# EAGLE schematic 31813A (EAGLE 7.5.0)

## Sheet 1 of 2
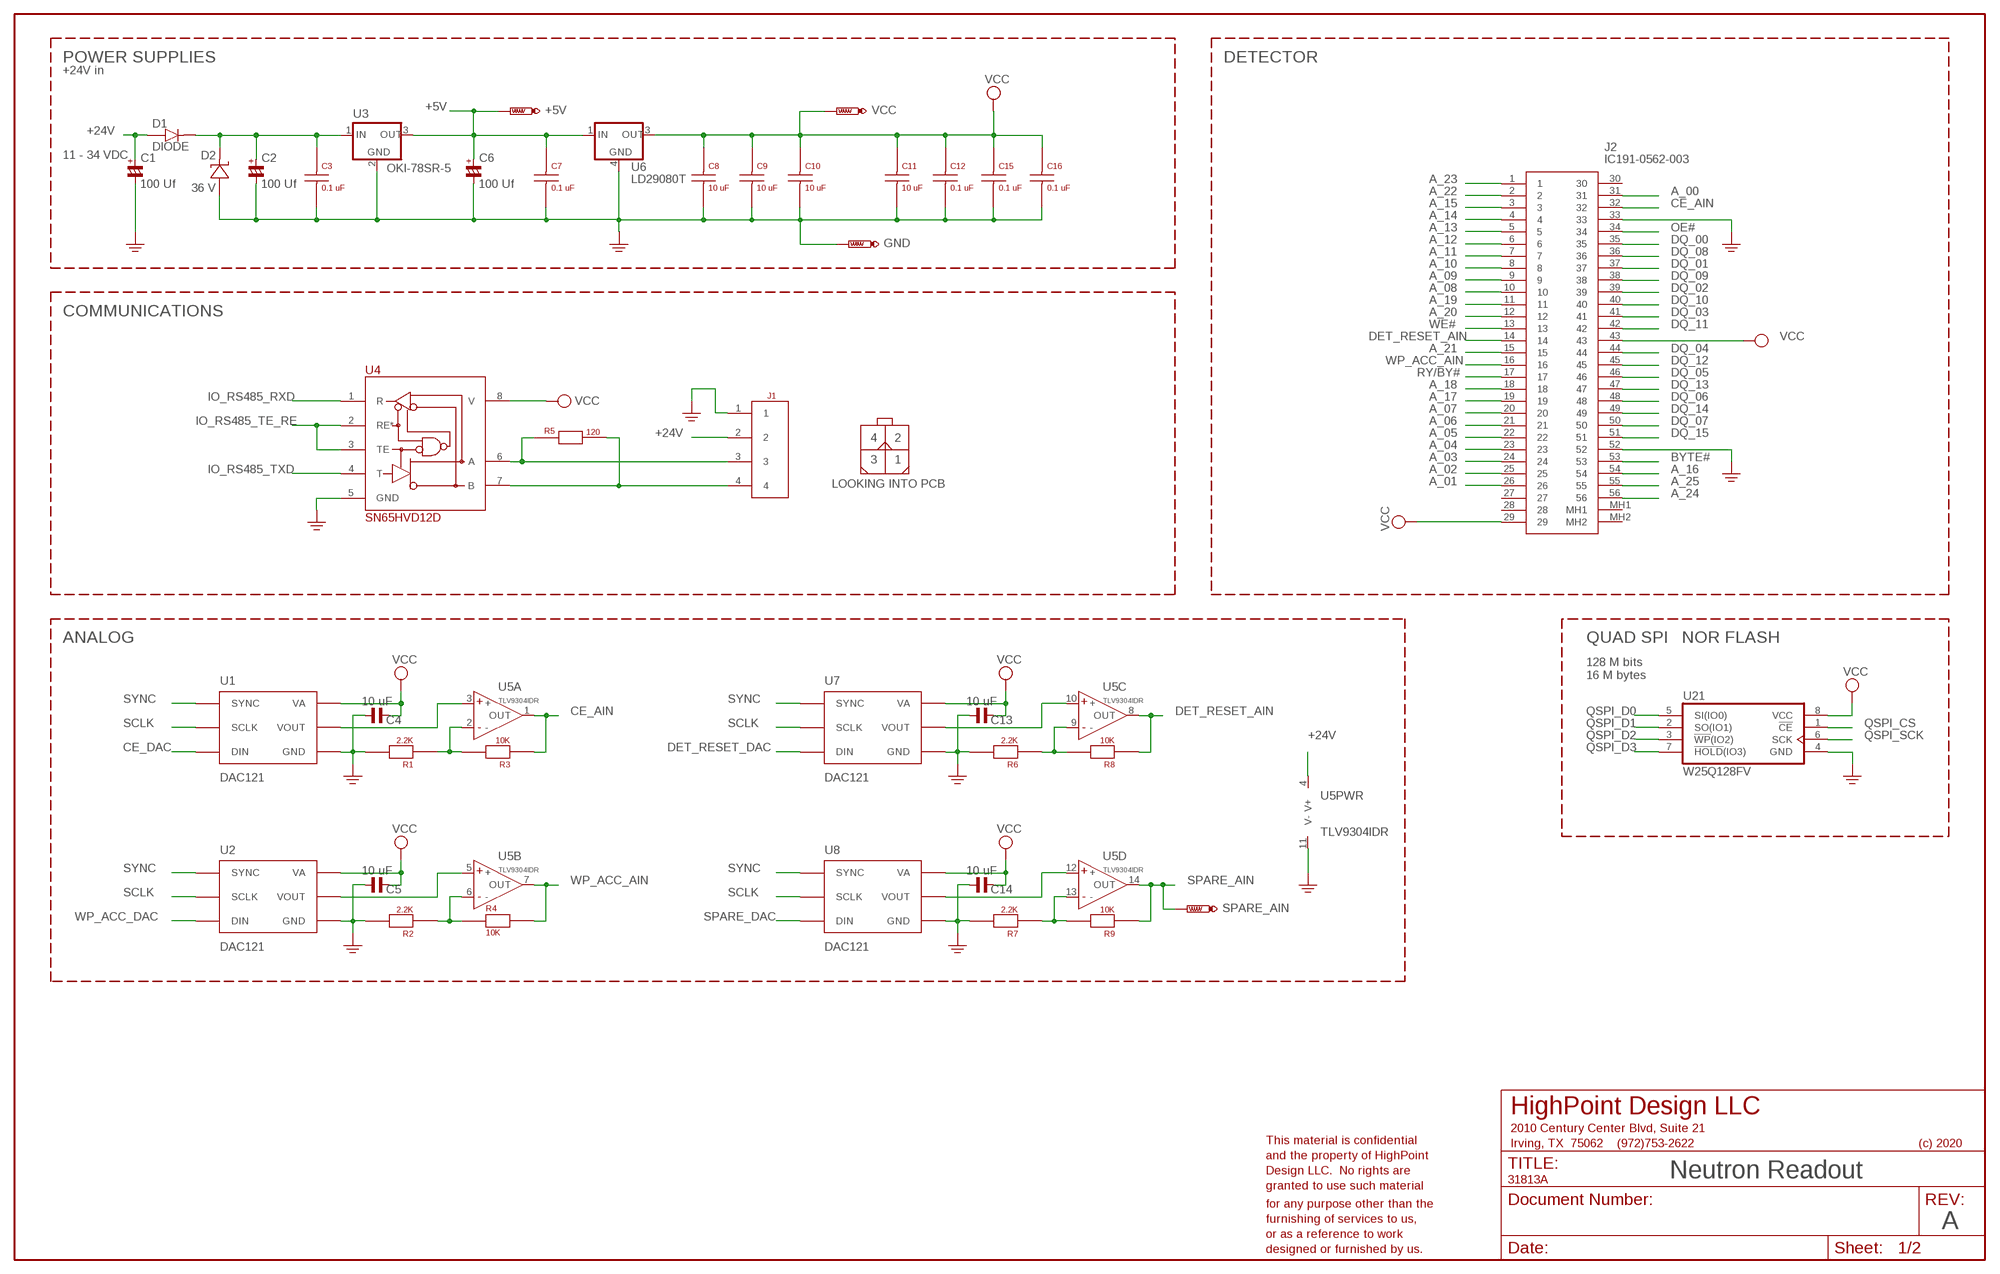
[diagram p0: schematic, sheet 1]

### Parts
+5V  TP  [TP8040]
C1  100 Uf  CAP_POL-E  [CSV-E/F]
C2  100 Uf  CAP_POL-E  [CSV-E/F]
C3  0.1 uF  CAP-0603  [0603]
C4  10 uF  CAP_SMD-0603  [0603]
C5  10 uF  CAP_SMD-0603  [0603]
C6  100 Uf  CAP_POL-E  [CSV-E/F]
C7  0.1 uF  CAP-0603  [0603]
C8  10 uF  CAP-0603  [0603]
C9  10 uF  CAP-0603  [0603]
C10  10 uF  CAP-0603  [0603]
C11  10 uF  CAP-0603  [0603]
C12  0.1 uF  CAP-0603  [0603]
C13  10 uF  CAP_SMD-0603  [0603]
C14  10 uF  CAP_SMD-0603  [0603]
C15  0.1 uF  CAP-0603  [0603]
C16  0.1 uF  CAP-0603  [0603]
D1  DIODE  [SOD-123_MINI-SMA]
D2  36 V  TRANSORB  [SMB]
GND  TP  [TP8040]
J1  MICRO-FIT-4POS  [43045-0412]
J2  IC191-0562-003  [IC1910562003]
R1  2.2K  RES-0603-H  [0603]
R2  2.2K  RES-0603-H  [0603]
R3  10K  RES-0603-H  [0603]
R4  10K  RES-0603-H  [0603]
R5  120  RES-0603-H  [0603]
R6  2.2K  RES-0603-H  [0603]
R7  2.2K  RES-0603-H  [0603]
R8  10K  RES-0603-H  [0603]
R9  10K  RES-0603-H  [0603]
SPARE_AIN  TP  [TP8040]
U1  DAC121  [SOT23-6]
U2  DAC121  [SOT23-6]
U3  OKI-78SR-5  PS-OKI-78SR  [PS-OKI-78SR]
U4  SN65HVD12D  [SOIC-08-150]
U5  TLV9304IDR  [SO14]
U6  LD29080T  [DPAK]
U7  DAC121  [SOT23-6]
U8  DAC121  [SOT23-6]
U21  W25Q128FV  IS25LQ080B-JB  [SO08-JB]
VCC  TP  [TP8040]

### Nets
+5V: +5V.1(TP) C6.+ C7.1 U3.3(OUT) U6.1(IN) ; also sheet 2
+24V: C1.+ D1.A J1.2 U5.4(PWR:V+)
A_00: J2.31 ; also sheet 2
A_01: J2.26 ; also sheet 2
A_02: J2.25 ; also sheet 2
A_03: J2.24 ; also sheet 2
A_04: J2.23 ; also sheet 2
A_05: J2.22 ; also sheet 2
A_06: J2.21 ; also sheet 2
A_07: J2.20 ; also sheet 2
A_08: J2.10 ; also sheet 2
A_09: J2.9 ; also sheet 2
A_10: J2.8 ; also sheet 2
A_11: J2.7 ; also sheet 2
A_12: J2.6 ; also sheet 2
A_13: J2.5 ; also sheet 2
A_14: J2.4 ; also sheet 2
A_15: J2.3 ; also sheet 2
A_16: J2.54 ; also sheet 2
A_17: J2.19 ; also sheet 2
A_18: J2.18 ; also sheet 2
A_19: J2.11 ; also sheet 2
A_20: J2.12 ; also sheet 2
A_21: J2.15 ; also sheet 2
A_22: J2.2 ; also sheet 2
A_23: J2.1 ; also sheet 2
A_24: J2.56 ; also sheet 2
A_25: J2.55 ; also sheet 2
BYTE#: J2.53 ; also sheet 2
CE_AIN: J2.32 R3.1 U5.1(A:OUT)
CE_DAC: U1.4(DIN) ; also sheet 2
DATA_A: J1.3 R5.1 U4.6(A)
DATA_B: J1.4 R5.2 U4.7(B)
DET_RESET_AIN: J2.14 R8.1 U5.8(C:OUT)
DET_RESET_DAC: U7.4(DIN) ; also sheet 2
DQ_00: J2.35 ; also sheet 2
DQ_01: J2.37 ; also sheet 2
DQ_02: J2.39 ; also sheet 2
DQ_03: J2.41 ; also sheet 2
DQ_04: J2.44 ; also sheet 2
DQ_05: J2.46 ; also sheet 2
DQ_06: J2.48 ; also sheet 2
DQ_07: J2.50 ; also sheet 2
DQ_08: J2.36 ; also sheet 2
DQ_09: J2.38 ; also sheet 2
DQ_10: J2.40 ; also sheet 2
DQ_11: J2.42 ; also sheet 2
DQ_12: J2.45 ; also sheet 2
DQ_13: J2.47 ; also sheet 2
DQ_14: J2.49 ; also sheet 2
DQ_15: J2.51 ; also sheet 2
GND: C1.- C2.- C3.2 C4.1 C5.1 C6.- C7.2 C8.2 C9.2 C10.2 C11.2 C12.2 C13.1 C14.1 C15.2 C16.2 D2.A GND.1(TP) J1.1 J2.33 J2.52 R1.2 R2.2 R6.2 R7.2 U1.2(GND) U2.2(GND) U3.2(GND) U4.5(GND) U5.11(PWR:V-) U6.4(GND) U7.2(GND) U8.2(GND) U21.4(GND) ; supply symbol labelled GND-DIGITAL ; also sheet 2
IO_RS485_RXD: U4.1(R) ; also sheet 2
IO_RS485_TE_RE: U4.2(RE*) U4.3(TE) ; also sheet 2
IO_RS485_TXD: U4.4(T) ; also sheet 2
N$9: U1.1(VOUT) U5.3(A:+)
N$10: U5.10(C:+) U7.1(VOUT)
N$16: R1.1 R3.2 U5.2(A:-)
N$17: U2.1(VOUT) U5.5(B:+)
N$18: R6.1 R8.2 U5.9(C:-)
N$19: R2.1 R4.1 U5.6(B:-)
N$20: U5.12(D:+) U8.1(VOUT)
N$21: R7.1 R9.2 U5.13(D:-)
N$22: C2.+ C3.1 D1.C D2.C U3.1(IN)
OE#: J2.34 ; also sheet 2
QSPI_CS: U21.1(!CE!) ; also sheet 2
QSPI_D0: U21.5(SI(IO0)) ; also sheet 2
QSPI_D1: U21.2(SO(IO1)) ; also sheet 2
QSPI_D2: U21.3(!WP!(IO2)) ; also sheet 2
QSPI_D3: U21.7(!HOLD!(IO3)) ; also sheet 2
QSPI_SCK: U21.6(SCK) ; also sheet 2
RY/BY#: J2.17 ; also sheet 2
SCLK: U1.5(SCLK) U2.5(SCLK) U7.5(SCLK) U8.5(SCLK) ; also sheet 2
SPARE_AIN: R9.1 SPARE_AIN.1(TP) U5.14(D:OUT)
SPARE_DAC: U8.4(DIN) ; also sheet 2
SYNC: U1.6(SYNC) U2.6(SYNC) U7.6(SYNC) U8.6(SYNC) ; also sheet 2
VCC: C4.2 C5.2 C8.1 C9.1 C10.1 C11.1 C12.1 C13.2 C14.2 C15.1 C16.1 J2.29 J2.43 U1.3(VA) U2.3(VA) U4.8(V) U6.3(OUT) U7.3(VA) U8.3(VA) U21.8(VCC) VCC.1(TP) ; also sheet 2
WE#: J2.13 ; also sheet 2
WP_ACC_AIN: J2.16 R4.2 U5.7(B:OUT)
WP_ACC_DAC: U2.4(DIN) ; also sheet 2
Unconnected: J2.27 J2.28 J2.30 J2.MH1 J2.MH2

### Notes on the sheet
- POWER SUPPLIES | DETECTOR
- +24V in
- 11 - 34 VDC
- COMMUNICATIONS
- ANALOG | QUAD SPI   NOR FLASH
- 128 M bits
  16 M bytes
- Neutron Readout
- A

## Sheet 2 of 2
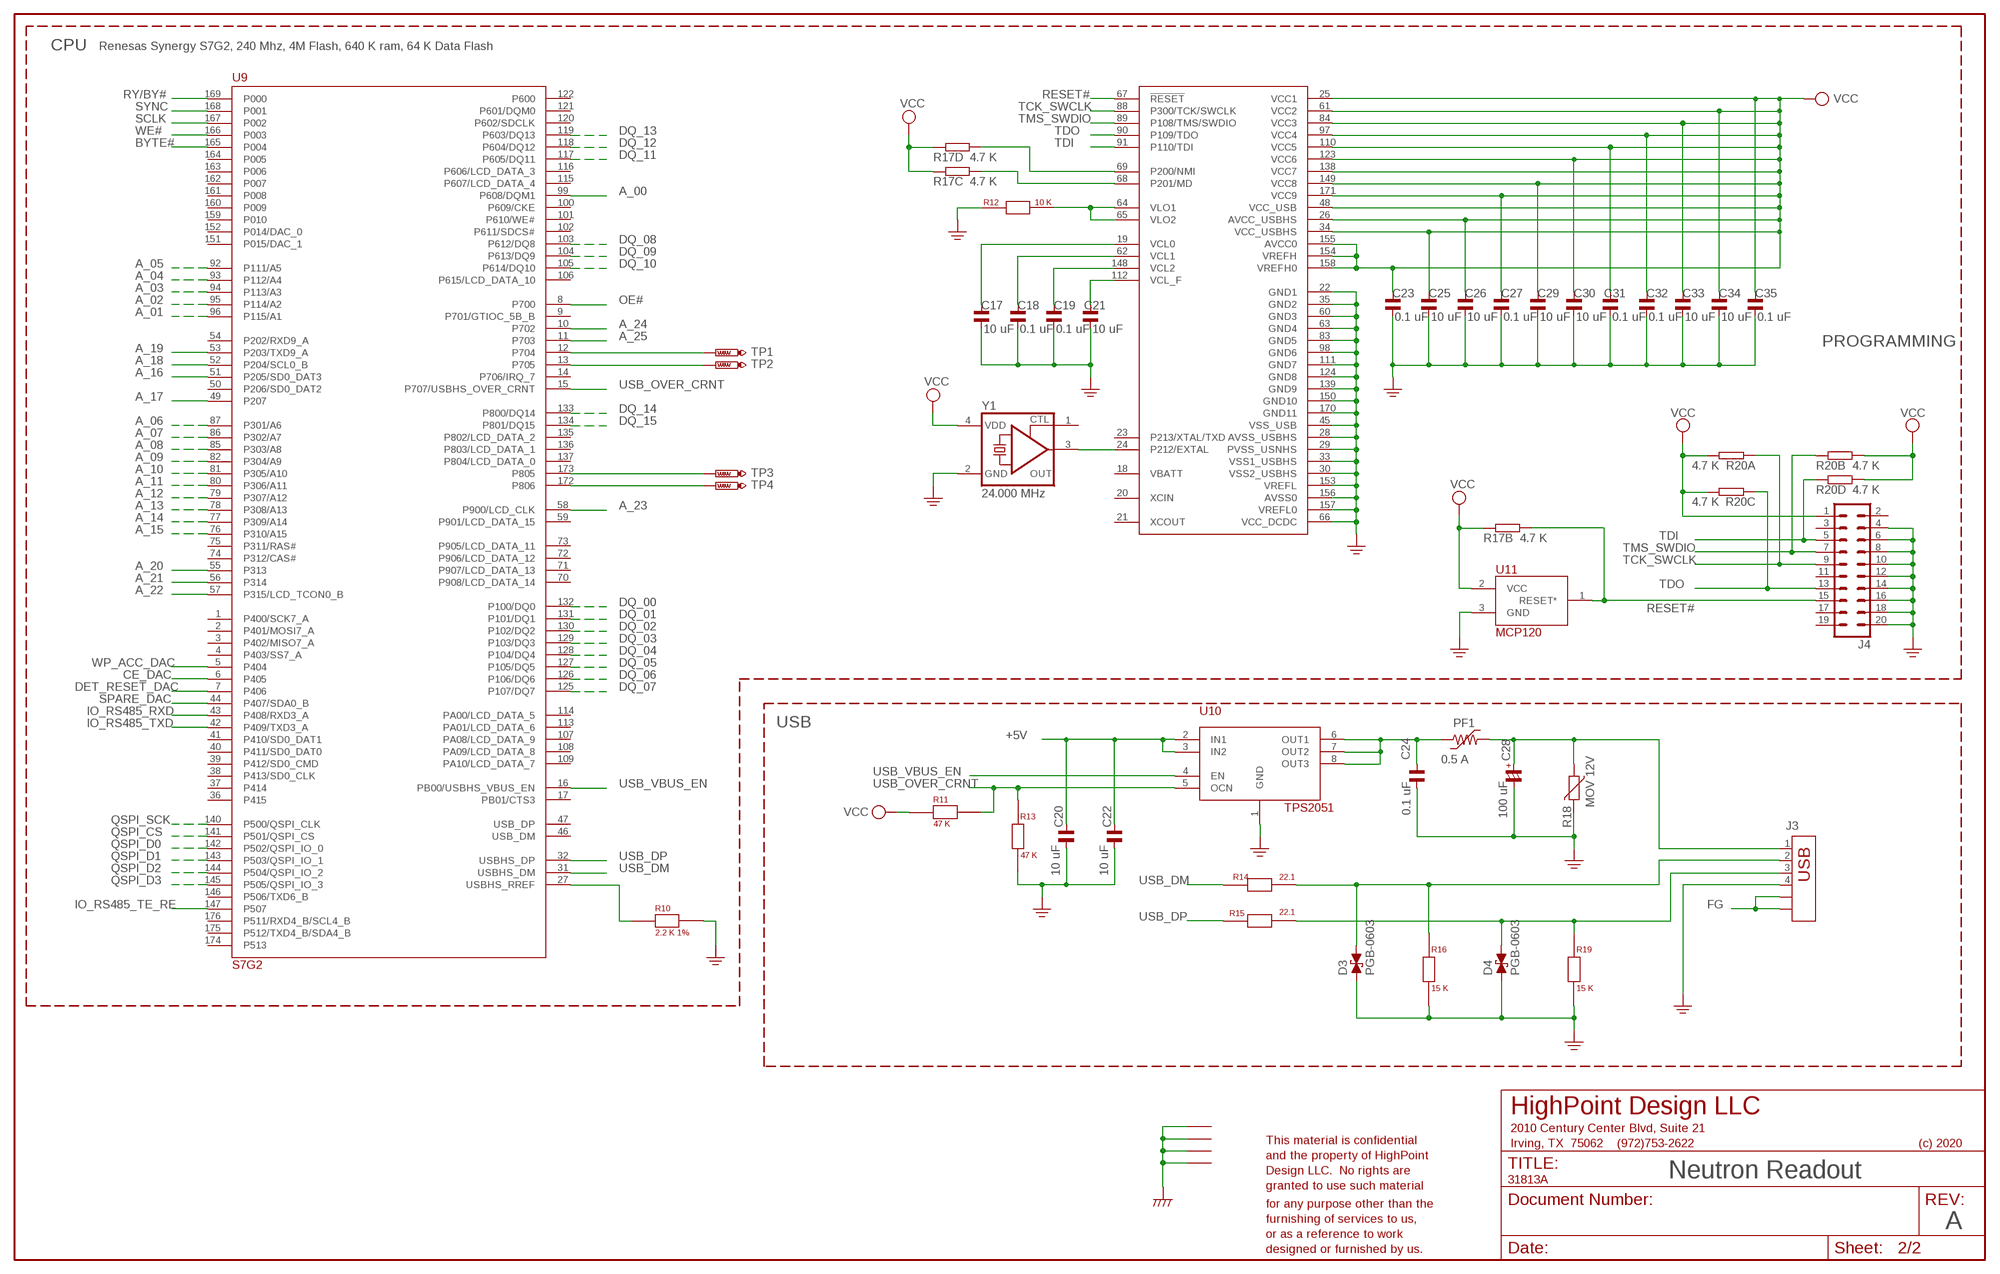
[diagram p1: schematic, sheet 2]

### Parts
C17  10 uF  CAP_SMD-0603  [0603]
C18  0.1 uF  CAP_SMD-0603  [0603]
C19  0.1 uF  CAP_SMD-0603  [0603]
C20  10 uF  CAP_SMD-0603  [0603]
C21  10 uF  CAP_SMD-0603  [0603]
C22  10 uF  CAP_SMD-0603  [0603]
C23  0.1 uF  CAP_SMD-0603  [0603]
C24  0.1 uF  CAP_SMD-0603  [0603]
C25  10 uF  CAP_SMD-0603  [0603]
C26  10 uF  CAP_SMD-0603  [0603]
C27  0.1 uF  CAP_SMD-0603  [0603]
C28  100 uF  CAP_POL-E  [CSV-E/F]
C29  10 uF  CAP_SMD-0603  [0603]
C30  10 uF  CAP_SMD-0603  [0603]
C31  0.1 uF  CAP_SMD-0603  [0603]
C32  0.1 uF  CAP_SMD-0603  [0603]
C33  10 uF  CAP_SMD-0603  [0603]
C34  10 uF  CAP_SMD-0603  [0603]
C35  0.1 uF  CAP_SMD-0603  [0603]
D3  PGB-0603  [PGB-0603]
D4  PGB-0603  [PGB-0603]
J3  CON-USB-292303-1  [USB]
J4  ML20  [ML20]
M1  MNT-125  [MNT-125]
M2  MNT-125  [MNT-125]
M3  MNT-125  [MNT-125]
M4  MNT-125  [MNT-125]
PF1  0.5 A  PTC-F1206  [F1206]
R10  2.2 K 1%  RES-0603-H  [0603]
R11  47 K  RES-0603-H  [0603]
R12  10 K  RES-0603-H  [0603]
R13  47 K  RES-0603-V  [0603]
R14  22.1  RES-0603-H  [0603]
R15  22.1  RES-0603-H  [0603]
R16  15 K  RES-0603-V  [0603]
R17  4.7 K  R_38V  [RNET-4R-38V]
R18  MOV 12V  VARISTOR-0603  [R0603]
R19  15 K  RES-0603-V  [0603]
R20  4.7 K  R_38V  [RNET-4R-38V]
TP1  TP  [TP8040]
TP2  TP  [TP8040]
TP3  TP  [TP8040]
TP4  TP  [TP8040]
U9  S7G2  S7G2-176  [LQFP176]
U10  TPS2051  [SOIC-8-SPECIAL]
U11  MCP120  [SOT23]
Y1  24.000 MHz  ASFL1  [ASFL1]

### Nets
+5V: C20.2 C22.2 U10.2(IN1) U10.3(IN2) ; also sheet 1
A_00: U9.99(P608/DQM1) ; also sheet 1
A_01: U9.96(P115/A1) ; also sheet 1
A_02: U9.95(P114/A2) ; also sheet 1
A_03: U9.94(P113/A3) ; also sheet 1
A_04: U9.93(P112/A4) ; also sheet 1
A_05: U9.92(P111/A5) ; also sheet 1
A_06: U9.87(P301/A6) ; also sheet 1
A_07: U9.86(P302/A7) ; also sheet 1
A_08: U9.85(P303/A8) ; also sheet 1
A_09: U9.82(P304/A9) ; also sheet 1
A_10: U9.81(P305/A10) ; also sheet 1
A_11: U9.80(P306/A11) ; also sheet 1
A_12: U9.79(P307/A12) ; also sheet 1
A_13: U9.78(P308/A13) ; also sheet 1
A_14: U9.77(P309/A14) ; also sheet 1
A_15: U9.76(P310/A15) ; also sheet 1
A_16: U9.51(P205/SD0_DAT3) ; also sheet 1
A_17: U9.49(P207) ; also sheet 1
A_18: U9.52(P204/SCL0_B) ; also sheet 1
A_19: U9.53(P203/TXD9_A) ; also sheet 1
A_20: U9.55(P313) ; also sheet 1
A_21: U9.56(P314) ; also sheet 1
A_22: U9.57(P315/LCD_TCON0_B) ; also sheet 1
A_23: U9.58(P900/LCD_CLK) ; also sheet 1
A_24: U9.10(P702) ; also sheet 1
A_25: U9.11(P703) ; also sheet 1
BYTE#: U9.165(P004) ; also sheet 1
CE_DAC: U9.6(P405) ; also sheet 1
DET_RESET_DAC: U9.7(P406) ; also sheet 1
DQ_00: U9.132(P100/DQ0) ; also sheet 1
DQ_01: U9.131(P101/DQ1) ; also sheet 1
DQ_02: U9.130(P102/DQ2) ; also sheet 1
DQ_03: U9.129(P103/DQ3) ; also sheet 1
DQ_04: U9.128(P104/DQ4) ; also sheet 1
DQ_05: U9.127(P105/DQ5) ; also sheet 1
DQ_06: U9.126(P106/DQ6) ; also sheet 1
DQ_07: U9.125(P107/DQ7) ; also sheet 1
DQ_08: U9.103(P612/DQ8) ; also sheet 1
DQ_09: U9.104(P613/DQ9) ; also sheet 1
DQ_10: U9.105(P614/DQ10) ; also sheet 1
DQ_11: U9.117(P605/DQ11) ; also sheet 1
DQ_12: U9.118(P604/DQ12) ; also sheet 1
DQ_13: U9.119(P603/DQ13) ; also sheet 1
DQ_14: U9.133(P800/DQ14) ; also sheet 1
DQ_15: U9.134(P801/DQ15) ; also sheet 1
FG: J3.S1 J3.S2 M1.1 M2.1 M3.1 M4.1
GND: C17.1 C18.1 C19.1 C20.1 C21.1 C22.1 C23.1 C24.1 C25.1 C26.1 C27.1 C28.- C29.1 C30.1 C31.1 C32.1 C33.1 C34.1 C35.1 D3.1 D4.1 J3.4 J4.4 J4.6 J4.8 J4.10 J4.12 J4.14 J4.16 J4.18 J4.20 R10.2 R12.1 R13.1 R16.1 R18.2 R19.1 U9.22(GND1) U9.28(AVSS_USBHS) U9.29(PVSS_USNHS) U9.30(VSS2_USBHS) U9.33(VSS1_USBHS) U9.35(GND2) U9.45(VSS_USB) U9.60(GND3) U9.63(GND4) U9.66(VCC_DCDC) U9.83(GND5) U9.98(GND6) U9.111(GND7) U9.124(GND8) U9.139(GND9) U9.150(GND10) U9.153(VREFL) U9.156(AVSS0) U9.157(VREFL0) U9.170(GND11) U10.1(GND) U11.3(GND) Y1.2(GND) ; supply symbol labelled GND-DIGITAL ; also sheet 1
IO_RS485_RXD: U9.43(P408/RXD3_A) ; also sheet 1
IO_RS485_TE_RE: U9.147(P507) ; also sheet 1
IO_RS485_TXD: U9.42(P409/TXD3_A) ; also sheet 1
N$1: R12.2 U9.64(VLO1) U9.65(VLO2)
N$2: R17.6 U9.68(P201/MD)
N$3: R17.5 U9.69(P200/NMI)
N$4: C17.2 U9.19(VCL0)
N$5: C18.2 U9.62(VCL1)
N$6: C19.2 U9.148(VCL2)
N$7: C21.2 U9.112(VCL_F)
N$8: U9.24(P212/EXTAL) Y1.3(OUT)
N$11: C24.2 PF1.1 U10.6(OUT1) U10.7(OUT2) U10.8(OUT3)
N$12: C28.+ J3.1 PF1.2 R18.1
N$13: D3.2 J3.2 R14.2 R16.2
N$14: R10.1 U9.27(USBHS_RREF)
N$15: D4.2 J3.3 R15.2 R19.2
N$23: TP3.1(TP) U9.173(P805)
N$24: TP4.1(TP) U9.172(P806)
N$25: TP1.1(TP) U9.12(P704)
N$26: TP2.1(TP) U9.13(P705)
OE#: U9.8(P700) ; also sheet 1
QSPI_CS: U9.141(P501/QSPI_CS) ; also sheet 1
QSPI_D0: U9.142(P502/QSPI_IO_0) ; also sheet 1
QSPI_D1: U9.143(P503/QSPI_IO_1) ; also sheet 1
QSPI_D2: U9.144(P504/QSPI_IO_2) ; also sheet 1
QSPI_D3: U9.145(P505/QSPI_IO_3) ; also sheet 1
QSPI_SCK: U9.140(P500/QSPI_CLK) ; also sheet 1
RESET#: J4.15 R17.7 U9.67(!RESET) U11.1(RESET*)
RY/BY#: U9.169(P000) ; also sheet 1
SCLK: U9.167(P002) ; also sheet 1
SPARE_DAC: U9.44(P407/SDA0_B) ; also sheet 1
SYNC: U9.168(P001) ; also sheet 1
TCK_SWCLK: J4.9 R20.1 U9.88(P300/TCK/SWCLK)
TDI: J4.5 R20.4 U9.91(P110/TDI)
TDO: J4.13 R20.3 U9.90(P109/TDO)
TMS_SWDIO: J4.7 R20.2 U9.89(P108/TMS/SWDIO)
USB_DM: R14.1 U9.31(USBHS_DM)
USB_DP: R15.1 U9.32(USBHS_DP)
USB_OVER_CRNT: R11.2 R13.2 U9.15(P707/USBHS_OVER_CRNT) U10.5(OCN)
USB_VBUS_EN: U9.16(PB00/USBHS_VBUS_EN) U10.4(EN)
VCC: C23.2 C25.2 C26.2 C27.2 C29.2 C30.2 C31.2 C32.2 C33.2 C34.2 C35.2 J4.1 R11.1 R17.2 R17.3 R17.4 R20.5 R20.6 R20.7 R20.8 U9.25(VCC1) U9.26(AVCC_USBHS) U9.34(VCC_USBHS) U9.48(VCC_USB) U9.61(VCC2) U9.84(VCC3) U9.97(VCC4) U9.110(VCC5) U9.123(VCC6) U9.138(VCC7) U9.149(VCC8) U9.154(VREFH) U9.155(AVCC0) U9.158(VREFH0) U9.171(VCC9) U11.2(VCC) Y1.4(VDD) ; also sheet 1
WE#: U9.166(P003) ; also sheet 1
WP_ACC_DAC: U9.5(P404) ; also sheet 1
Unconnected: J4.2 J4.3 J4.11 J4.17 J4.19 R17.1 R17.8 U9.1(P400/SCK7_A) U9.2(P401/MOSI7_A) U9.3(P402/MISO7_A) U9.4(P403/SS7_A) U9.9(P701/GTIOC_5B_B) U9.14(P706/IRQ_7) U9.17(PB01/CTS3) U9.18(VBATT) U9.20(XCIN) U9.21(XCOUT) U9.23(P213/XTAL/TXD) U9.36(P415) U9.37(P414) U9.38(P413/SD0_CLK) U9.39(P412/SD0_CMD) U9.40(P411/SD0_DAT0) U9.41(P410/SD0_DAT1) U9.46(USB_DM) U9.47(USB_DP) U9.50(P206/SD0_DAT2) U9.54(P202/RXD9_A) U9.59(P901/LCD_DATA_15) U9.70(P908/LCD_DATA_14) U9.71(P907/LCD_DATA_13) U9.72(P906/LCD_DATA_12) U9.73(P905/LCD_DATA_11) U9.74(P312/CAS#) U9.75(P311/RAS#) U9.100(P609/CKE) U9.101(P610/WE#) U9.102(P611/SDCS#) U9.106(P615/LCD_DATA_10) U9.107(PA08/LCD_DATA_9) U9.108(PA09/LCD_DATA_8) U9.109(PA10/LCD_DATA_7) U9.113(PA01/LCD_DATA_6) U9.114(PA00/LCD_DATA_5) U9.115(P607/LCD_DATA_4) U9.116(P606/LCD_DATA_3) U9.120(P602/SDCLK) U9.121(P601/DQM0) U9.122(P600) U9.135(P802/LCD_DATA_2) U9.136(P803/LCD_DATA_1) U9.137(P804/LCD_DATA_0) U9.146(P506/TXD6_B) U9.151(P015/DAC_1) U9.152(P014/DAC_0) U9.159(P010) U9.160(P009) U9.161(P008) U9.162(P007) U9.163(P006) U9.164(P005) U9.174(P513) U9.175(P512/TXD4_B/SDA4_B) U9.176(P511/RXD4_B/SCL4_B) Y1.1(CTL)

### Notes on the sheet
- CPU | Renesas Synergy S7G2, 240 Mhz, 4M Flash, 640 K ram, 64 K Data Flash
- PROGRAMMING
- USB
- Neutron Readout
- A

## Library data of the parts
+5V GND SPARE_AIN TP1-TP4 VCC = 31382 Display PCB:TP: TEST PIN
C1 C2 C6 C28 = 31382 Display PCB:CAP_POL: Polarized caps surface mount
C3 C7-C12 C15 C16 = 31382 Display PCB:CAP: Surfave mount caps various sizes all non-polar
C4 C5 C13 C14 = 31813 Neutron Readout PCB:CAP_SMD: Surface mount caps
C17-C27 C29-C35 = 31382 Display PCB:CAP_SMD: Surface mount caps
D1 = 31813 Neutron Readout PCB:DIODE: General purpose diode
D2 = 31382 Display PCB:TRANSORB: 600 watt transorb smb style smd, 400 watt sma style
D3 D4 = 31382 Display PCB:PGB-0603: ESD SUPPRESSOR
J1 = 31382 Display PCB:MICRO-FIT-4POS: Micro Fit 3.0 male header 4 position
J2 = 31813 Neutron Readout PCB:IC191-0562-003: IC & Component Sockets 56Pin TSOP Burn-in Skt 0.50 pitch Source: Datasheet; DESCRIPTION: IC & Component Sockets 56Pin TSOP Burn-in Skt 0.50 pitch; HEIGHT: 19.2mm; MANUFACTURER_NAME: Yamaichi; MANUFACTURER_PART_NUMBER: IC191-0562-003; MOUSER_PART_NUMBER: 945-IC191-0562-003; MOUSER_PRICE-STOCK: https://www.mouser.com/Search/Refine.aspx?Keyword=945-IC191-0562-003
J3 = 31382 Display PCB:CON-USB-292303-1: AMP connector
J4 = 31382 Display PCB:ML20: HARTING
M1-M4 = 31382 Display PCB:MNT: Mounting holes
PF1 = 31382 Display PCB:PTC-: POLYSWITCH Polyswitch Resetable Fuses
R1-R4 R6-R9 = 31813 Neutron Readout PCB:RES-0603-H: Resistor 0603 package horizontal schematic symbol
R5 R10-R12 R14 R15 = 31382 Display PCB:RES-0603-H: Resistor 0603 package horizontal schematic symbol
R13 R16 R19 = 31382 Display PCB:RES-0603-V: Resistor 0603 package vertical schematic symbol
R17 R20 = 31382 Display PCB:R_38V: SMT resistor pack 4 resistors, Pabnasonic 38V, Rohm MNR14
R18 = 31382 Display PCB:VARISTOR: VARISTOR
U1 U2 U7 U8 = 31813 Neutron Readout PCB:DAC121: Earth ground symbol, named FG
U3 = 31382 Display PCB:PS-OKI-78SR: Murata OKI 5W 7-32 Vin Regulator
U4 = 31382 Display PCB:SN65HVD12D: 3.3 V RS485 tranceiver - Texas Instruments
U5 = 31813 Neutron Readout PCB:TLV9304: Texas Instruments TLV9304 Opamp
U6 = 31382 Display PCB:LD29080: LDO Regulator LD29150 series
U9 = 31382 Display PCB:S7G2-176: Synergy S7G2 - LQFP 176
U10 = 31382 Display PCB:TPS2051
U11 = 31382 Display PCB:MCP120: Three pin reset - supervisor circuit with fixed delay, open drain
U21 = 31813 Neutron Readout PCB:IS25LQ080B-: EEPROM - 8 Mbit Serial Flash 3V QUAD SERIAL FLASH MEMORY WITH MULTI-I/O SPI
Y1 = 31382 Display PCB:ASFL1: CRYSTAL OSCILLATOR - Abracon